# EasyEDA Pro project compute-module-v101.eprj, board main-board
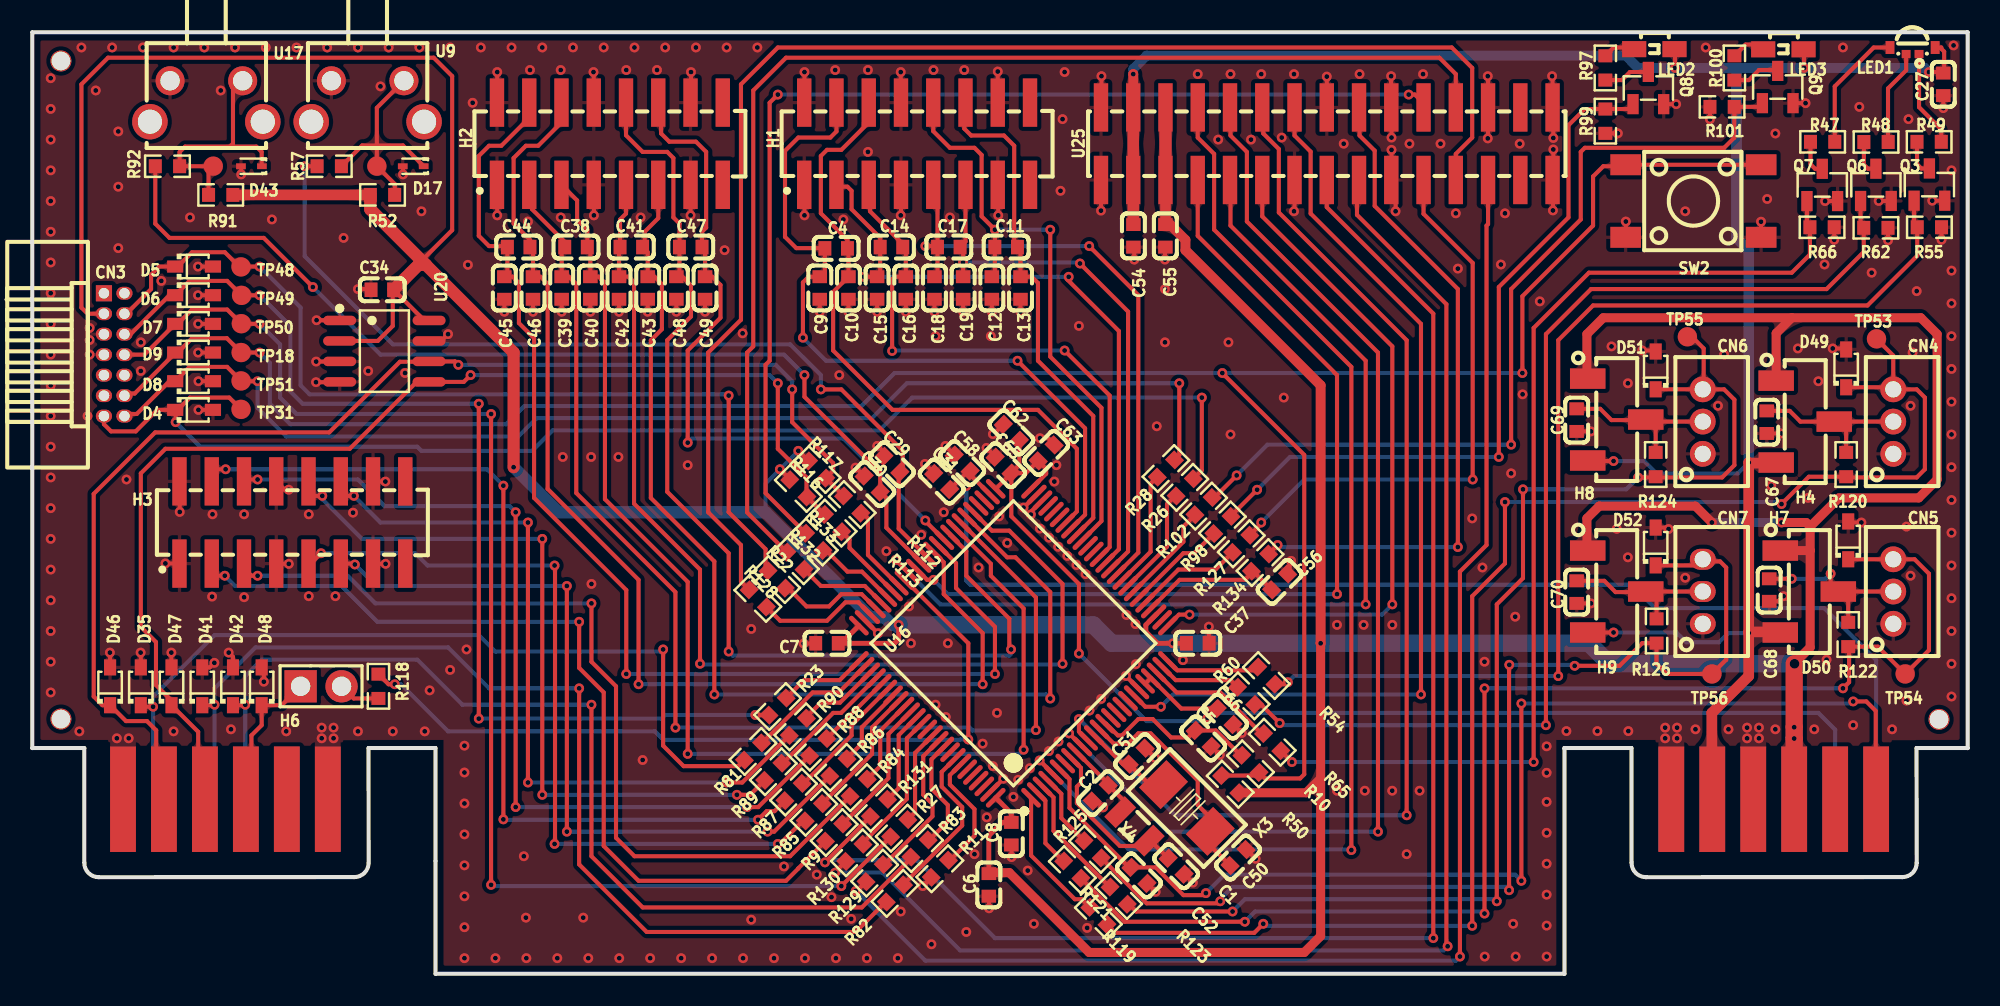
[diagram p8: board, top side]
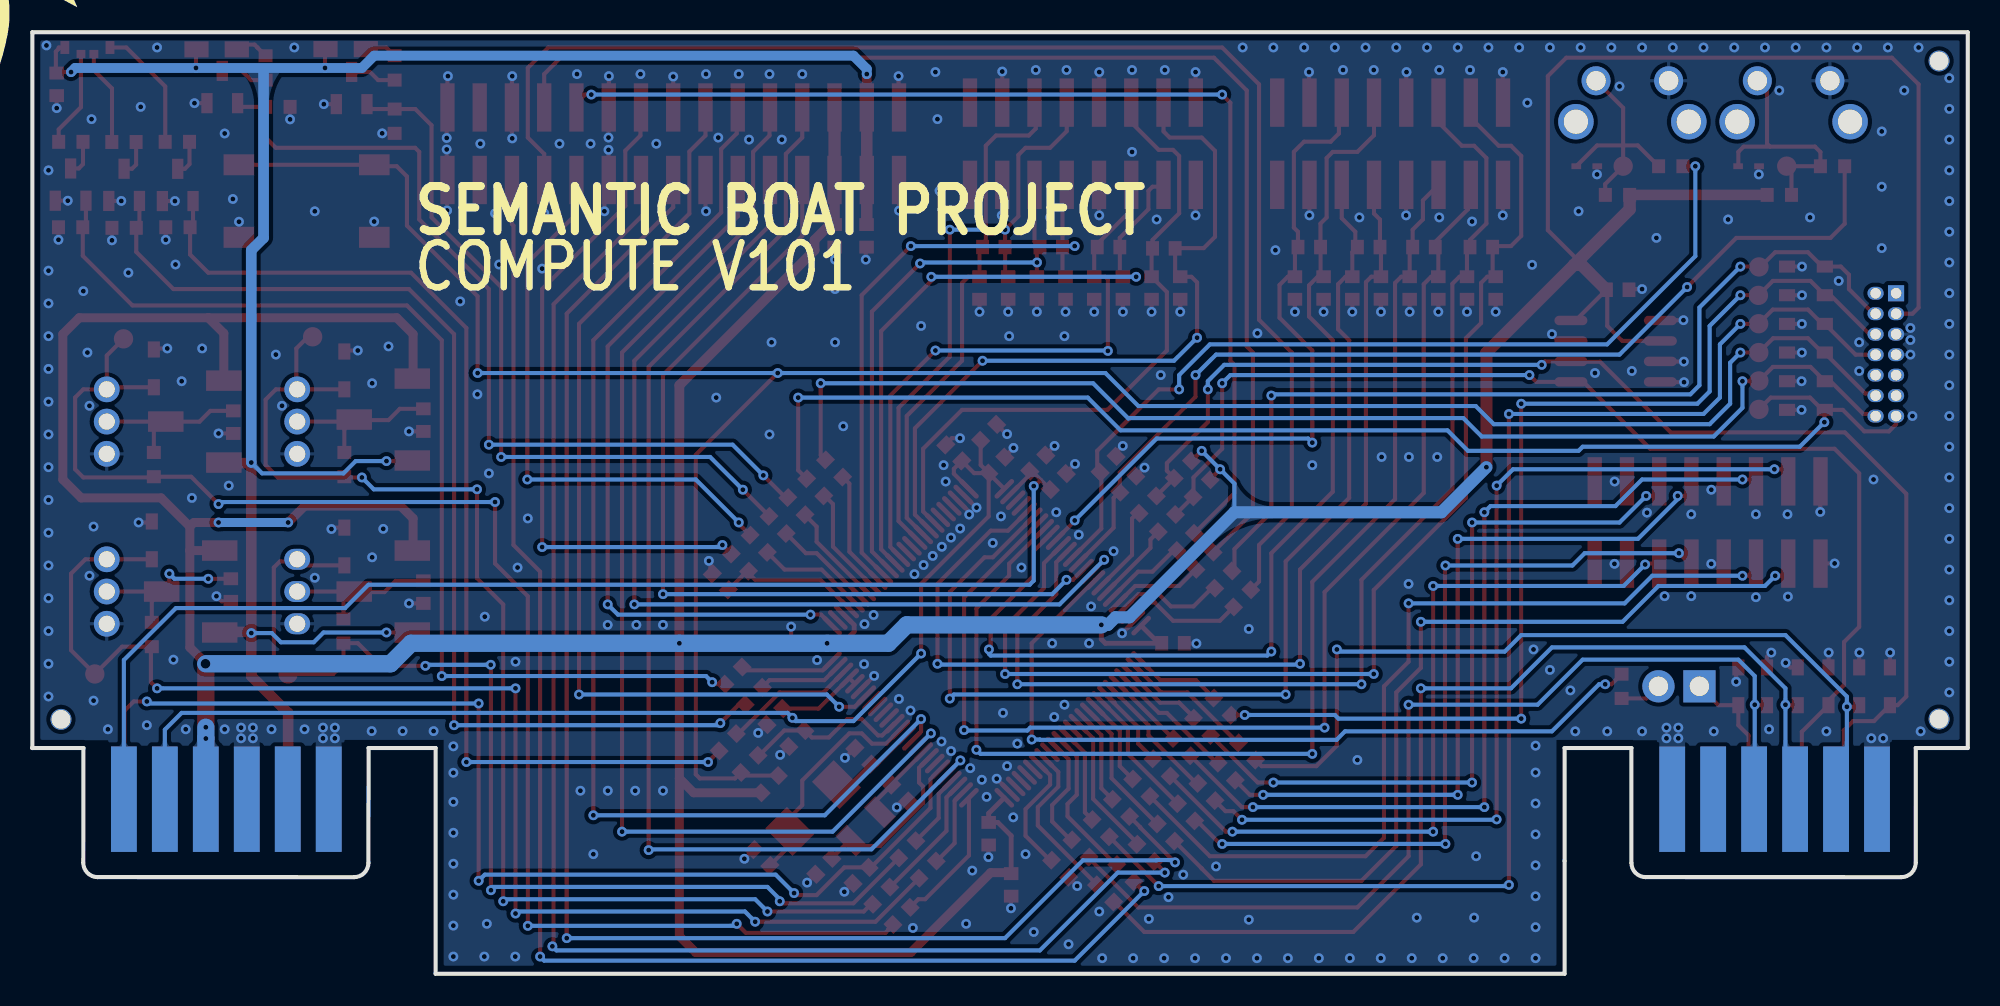
[diagram p9: board, bottom side, seen from below]

Outline 120.01 x 58.4 mm; copper layers: Top Layer, Inner1, Inner2, Bottom Layer. Coordinates in mm from the lower left corner of the outline.
Outline path: 120,14 120,58.4 0,58.4 0,14 3.22,14 3.23,6.88 arc(3.49,6.25) 4.11,5.99 19.96,5.99 arc(20.59,6.25) 20.86,6.88 20.85,14 25,14 25,0 95,0 95,14 99.16,14 99.16,6.88 arc(99.42,6.25) 100.05,5.99 115.95,5.99 arc(116.58,6.25) 116.84,6.88 116.83,14 120,14 ; 120,14 120.01,14
Stack: Top Layer 0.035mm Outer layer thickness 1oz / Dielectric1 0.2104mm 7628 RC49% 8.6mil / Inner1 0.0152mm Inner layer thickness / Dielectric2 1.065mm 1.1mm H/HOZ Copper / Inner2 0.0152mm Inner layer thickness / Dielectric3 0.2104mm 7628 RC49% 8.6mil / Bottom Layer 0.035mm Outer layer thickness 1oz

## Design rules (mm)
template: JLCPCB Capability(Two Layers Board)
spacing copperThickness1oz (default): track to track 0.102, other pairs 0.152 to 0.3
spacing copperThickness2oz: track to track 0.203, other pairs 0.152 to 0.3
track width copperThickness1oz (default): min 0.127, default 0.254, max 2.54
track width copperThickness2oz: min 0.203, default 0.254, max 2.54
differential pair differentialPair (default): width min 0.127, default 0.254, max 2.54; gap min 0.152, default 0.152
via viaSize (default): diameter min 0.5, default 0.61, max 10; hole min 0.3, default 0.305, max 6.3

## Placement (name value [footprint] x y rotation side)
C1  22pF  [C0603]  70.93 6.67 135 top
C2  22pF  [C0603]  66.22 11.21 45 top
C4  2.2nF  [C0603]  49.84 44.99 0 top
C5  100nF  [C0603]  72.6 14.59 135 top
C6  22uF  [C0603]  59.31 5.51 90 top
C7  100nF  [C0603]  49.28 20.5 180 top
C8  100nF  [C0603]  60.71 8.69 270 top
C9  22nF  [C0603]  48.83 42.54 270 top
C10  22nF  [C0603]  50.61 42.54 270 top
C11  2.2nF  [C0603]  60.38 45.08 0 top
C12  22nF  [C0603]  59.5 42.54 270 top
C13  22nF  [C0603]  61.27 42.54 270 top
C14  2.2nF  [C0603]  53.27 45.08 0 top
C15  22nF  [C0603]  52.38 42.54 270 top
C16  22nF  [C0603]  54.16 42.54 270 top
C17  2.2nF  [C0603]  56.83 45.08 0 top
C18  22nF  [C0603]  55.94 42.54 270 top
C19  22nF  [C0603]  57.72 42.54 270 top
C27  100nF  [C0603]  118.49 55.17 270 top
C29  100nF  [C0603]  53.3 31.6 315 top
C30  100nF  [C0603]  52.08 30.38 315 top
C31  1uF  [C0603]  56.39 30.53 315 top
C34  100nF  [C0603]  21.7 42.43 0 top
C37  100nF  [C0603]  72.26 20.5 0 top
C38  2.2nF  [C0603]  33.72 45.08 0 top
C39  22nF  [C0603]  32.83 42.54 270 top
C40  22nF  [C0603]  34.6 42.54 270 top
C41  2.2nF  [C0603]  37.14 45.08 0 top
C42  22nF  [C0603]  36.38 42.54 270 top
C43  22nF  [C0603]  38.16 42.54 270 top
C44  2.2nF  [C0603]  30.16 45.08 0 top
C45  22nF  [C0603]  29.27 42.54 270 top
C46  22nF  [C0603]  31.05 42.54 270 top
C47  2.2nF  [C0603]  40.83 45.08 0 top
C48  22nF  [C0603]  39.94 42.54 270 top
C49  22nF  [C0603]  41.72 42.54 270 top
C50  33pF  [C0603]  74.76 7.21 225 top
C51  33pF  [C0603]  68.5 13.5 225 top
C52  100nF  [C0603]  68.62 6.1 315 top
C54  10uF  [C0603]  68.28 45.77 90 top
C55  10uF  [C0603]  70.26 45.77 270 top
C56  10uF  [C0603]  77.34 24.31 45 top
C58  100nF  [C0603]  57.66 31.67 315 top
C62  4.7uF  [C0603]  60.71 33.58 135 top
C63  100nF  [C0603]  62.87 32.31 45 top
C65  100nF  [C0603]  60.2 31.55 135 top
C66  100nF  [C0603]  73.96 15.95 315 top
C67  10uF  [C0603]  107.54 34.21 90 top
C68  10uF  [C0603]  107.7 23.8 90 top
C69  10uF  [C0603]  95.76 34.34 90 top
C70  10uF  [C0603]  95.76 23.67 90 top
CN3  HX PZ1.27-2x7P WZ  [HDR-TH_14P-P1.27-H-M-R2-C7-S1.27-W7.5-N]  5.08 38.4 270 top
CN4  B3B-PH-K-S(LF)(SN)  [CONN-TH_B3B-PH-K-S]  115.39 34.25 270 top
CN5  B3B-PH-K-S(LF)(SN)  [CONN-TH_B3B-PH-K-S]  115.39 23.71 270 top
CN6  B3B-PH-K-S(LF)(SN)  [CONN-TH_B3B-PH-K-S]  103.58 34.25 270 top
CN7  B3B-PH-K-S(LF)(SN)  [CONN-TH_B3B-PH-K-S#2]  103.58 23.71 270 top
D4  PESD5V0U1UA,115  [SOD-323_L1.8-W1.3-LS2.5-RD]  10.03 34.98 0 top
D5  PESD5V0U1UA,115  [SOD-323_L1.8-W1.3-LS2.5-RD]  10.03 43.87 0 top
D6  PESD5V0U1UA,115  [SOD-323_L1.8-W1.3-LS2.5-RD]  10.03 42.09 0 top
D7  PESD5V0U1UA,115  [SOD-323_L1.8-W1.3-LS2.5-RD]  10.03 40.31 0 top
D8  PESD5V0U1UA,115  [SOD-323_L1.8-W1.3-LS2.5-RD]  10.03 36.75 0 top
D9  PESD5V0U1UA,115  [SOD-323_L1.8-W1.3-LS2.5-RD]  10.03 38.53 0 top
D17  PESD3V3S1UB,115  [SOD-523_L1.2-W0.8-LS1.6-RD]  23.62 50.09 180 top
D35  PESD5V0U1UA,115  [SOD-323_L1.8-W1.3-LS2.5-RD]  6.73 17.83 90 top
D41  PESD5V0U1UA,115  [SOD-323_L1.8-W1.3-LS2.5-RD]  10.54 17.83 90 top
D42  PESD5V0U1UA,115  [SOD-323_L1.8-W1.3-LS2.5-RD]  12.45 17.83 90 top
D43  PESD3V3S1UB,115  [SOD-523_L1.2-W0.8-LS1.6-RD]  13.59 50.09 180 top
D46  PESD5V0U1UA,115  [SOD-323_L1.8-W1.3-LS2.5-RD]  4.83 17.83 90 top
D47  PESD5V0U1UA,115  [SOD-323_L1.8-W1.3-LS2.5-RD]  8.64 17.83 90 top
D48  PESD5V0U1UA,115  [SOD-323_L1.8-W1.3-LS2.5-RD]  14.22 17.83 90 top
D49  PESD5V0U1UA,115  [SOD-323_L1.8-W1.3-LS2.5-RD]  112.47 37.55 90 top
D50  PESD5V0U1UA,115  [SOD-323_L1.8-W1.3-LS2.5-RD]  112.59 26.88 90 top
D51  PESD5V0U1UA,115  [SOD-323_L1.8-W1.3-LS2.5-RD]  100.66 37.42 90 top
D52  PESD5V0U1UA,115  [SOD-323_L1.8-W1.3-LS2.5-RD]  100.66 26.5 90 top
H1  XDZ200-2-08-S-2.0-G1  [HDR-SMD_16P-P2.00-V-M-R2-C8-LS6.5]  54.86 51.49 0 top
H2  XDZ200-2-08-S-2.0-G1  [HDR-SMD_16P-P2.00-V-M-R2-C8-LS6.5]  35.81 51.49 0 top
H3  XDZ200-2-08-S-2.0-G1  [HDR-SMD_16P-P2.00-V-M-R2-C8-LS6.5]  16.13 27.99 0 top
H4  X6511WVS-03H-C60D48R2  [HDR-SMD_3P-P2.54_XKB_X6511WVS-03H-C60D48R2]  109.93 34.25 270 top
H6  PZ254V-11-02P  [HDR-TH_2P-P2.54-V-M]  17.91 17.83 0 top
H7  X6511WVS-03H-C60D48R2  [HDR-SMD_3P-P2.54_XKB_X6511WVS-03H-C60D48R2]  110.18 23.71 270 top
H8  X6511WVS-03H-C60D48R2  [HDR-SMD_3P-P2.54_XKB_X6511WVS-03H-C60D48R2]  98.24 34.38 270 top
H9  X6511WVS-03H-C60D48R2  [HDR-SMD_3P-P2.54_XKB_X6511WVS-03H-C60D48R2]  98.24 23.71 270 top
LED1  MHS110RGBCT  [LED-ARRAY-SMD_MHS110RGBCT]  116.59 57.25 0 top
LED2  LTST-S220TGKT  [LED-SMD_L2.2-W0.6-RD_GREEN]  100.57 57.35 0 top
LED3  LTST-S220TGKT  [LED-SMD_L2.2-W0.6-RD_GREEN]  108.57 57.34 0 top
NOREF  -  [Pad_e36]  1.78 56.62 270 top
NOREF#2  -  [Pad_e35]  1.78 15.8 0 top
NOREF#3  -  [Pad_e37]  118.22 15.78 90 top
Q3  2N7002  [SOT-23-3_L2.9-W1.3-P1.90-LS2.4-BR]  117.63 48.95 270 top
Q6  2N7002  [SOT-23-3_L2.9-W1.3-P1.90-LS2.4-BR]  114.31 48.94 270 top
Q7  2N7002  [SOT-23-3_L2.9-W1.3-P1.90-LS2.4-BR]  110.99 48.93 270 top
Q8  2N7002  [SOT-23-3_L2.9-W1.3-P1.90-LS2.4-BR]  100.2 54.94 270 top
Q9  2N7002  [SOT-23-3_L2.9-W1.3-P1.90-LS2.4-BR]  108.22 55 270 top
R9  1kΩ  [R0603]  49.72 8.76 225 top
R10  220Ω  [R0603]  75.53 13.02 135 top
R11  47kΩ  [R0603]  56.27 6.51 45 top
R22  47Ω  [R0603]  46.15 24.45 135 top
R23  47Ω  [R0603]  46.21 16.57 225 top
R26  100Ω  [R0603]  71.46 30.17 45 top
R27  100Ω  [R0603]  53.76 9.03 225 top
R28  100Ω  [R0603]  70.29 31.34 45 top
R47  120Ω  [R0603]  111.01 51.6 0 top
R48  100Ω  [R0603]  114.32 51.59 0 top
R49  100Ω  [R0603]  117.61 51.6 0 top
R50  10kΩ  [R0603]  74.28 11.76 315 top
R52  10kΩ  [R0603]  21.72 48.31 180 top
R54  100Ω  [R0603]  76.52 18.5 135 top
R55  100kΩ  [R0603]  117.63 46.3 0 top
R57  1kΩ  [R0603]  18.42 50.09 180 top
R60  100Ω  [R0603]  75.26 17.24 315 top
R62  100kΩ  [R0603]  114.31 46.27 0 top
R65  100Ω  [R0603]  76.88 14.36 315 top
R66  100kΩ  [R0603]  110.97 46.3 0 top
R81  47Ω  [R0603]  44.69 13.79 225 top
R82  47Ω  [R0603]  53.49 4.99 225 top
R83  47Ω  [R0603]  55.01 7.77 225 top
R84  1kΩ  [R0603]  51.24 11.54 225 top
R85  1kΩ  [R0603]  48.46 10.02 225 top
R86  1kΩ  [R0603]  49.99 12.8 225 top
R87  1kΩ  [R0603]  47.2 11.27 225 top
R88  1kΩ  [R0603]  48.73 14.06 225 top
R89  1kΩ  [R0603]  45.94 12.53 225 top
R90  1kΩ  [R0603]  47.47 15.31 225 top
R91  10kΩ  [R0603]  11.68 48.31 0 top
R92  1kΩ  [R0603]  8.38 50.09 180 top
R97  120Ω  [R0603]  97.54 56.19 90 top
R98  100Ω  [R0603]  73.79 27.84 225 top
R99  100kΩ  [R0603]  97.54 52.88 270 top
R100  120Ω  [R0603]  105.54 56.19 90 top
R101  100kΩ  [R0603]  104.78 53.77 180 top
R102  100Ω  [R0603]  72.62 29.01 225 top
R112  47Ω  [R0603]  50.84 29.1 135 top
R113  47Ω  [R0603]  49.65 27.95 135 top
R116  2.2kΩ  [R0603]  47.5 30.11 135 top
R117  2.2kΩ  [R0603]  48.67 31.28 135 top
R118  330Ω  [R0603]  21.46 17.83 270 top
R119  220Ω  [R0603]  66.1 3.59 315 top
R120  4.7kΩ  [R0603]  112.47 31.58 270 top
R121  220Ω  [R0603]  64.49 6.46 315 top
R122  4.7kΩ  [R0603]  112.59 21.04 270 top
R123  220Ω  [R0603]  67.36 4.84 315 top
R124  4.7kΩ  [R0603]  100.66 31.58 270 top
R125  220Ω  [R0603]  65.75 7.72 315 top
R126  4.7kΩ  [R0603]  100.71 21.26 270 top
R127  47Ω  [R0603]  74.96 26.67 45 top
R128  47Ω  [R0603]  44.99 23.28 135 top
R129  47Ω  [R0603]  52.23 6.24 225 top
R130  47Ω  [R0603]  50.97 7.5 225 top
R131  47Ω  [R0603]  52.5 10.29 225 top
R132  47Ω  [R0603]  47.32 25.62 315 top
R133  47Ω  [R0603]  48.49 26.79 315 top
R134  33Ω  [R0603]  76.13 25.5 225 top
SW2  TS-1002S-05026C  [KEY-SMD_4P-L6.0-W6.0-P4.50-LS9.0]  103 47.93 0 top
TP17  -  [Test-Point-0.5mm]  21.37 50.09 180 top
TP18  -  [Test-Point-0.5mm]  12.95 38.53 0 top
TP31  -  [Test-Point-0.5mm]  12.95 35.01 0 top
TP48  -  [Test-Point-0.5mm]  12.94 43.84 0 top
TP49  -  [Test-Point-0.5mm]  12.98 42.08 0 top
TP50  -  [Test-Point-0.5mm]  12.96 40.32 0 top
TP51  -  [Test-Point-0.5mm]  12.95 36.77 0 top
TP52  -  [Test-Point-0.5mm]  11.22 50.09 180 top
TP53  -  [Test-Point-0.5mm]  114.35 39.38 270 top
TP54  -  [Test-Point-0.5mm]  116.13 18.59 0 top
TP55  -  [Test-Point-0.5mm]  102.62 39.51 270 top
TP56  -  [Test-Point-0.5mm]  104.15 18.59 180 top
U9  TC-6615-9.0-160G  [KEY-TH_PTS645VXX83XLFS]  20.8 54.12 180 top
U16  STM32F373VCT6  [LQFP-100_L14.0-W14.0-P0.50-LS16.0-BL]  60.83 20.5 45 top
U17  TC-6615-9.0-160G  [KEY-TH_PTS645VXX83XLFS]  10.8 54.12 180 top
U20  AT24C256C-SSHL-T  [SOIC-8_L4.9-W3.9-P1.27-LS6.0-BL]  21.83 38.62 270 top
U23  -  [ED12BGFBK-CARD]  108 6 0 top
U24  -  [ED12BGFBK-CARD]  12 6 0 top
U25  XDZ200-2-15-S-2.0-G1  [HDR-SMD_30P-P2.00-V-M-R2-C15-LS6.5]  80.26 51.49 0 top
X3  8MHz  [CRYSTAL-SMD_L5.0-W3.2]  71.59 10.28 135 top
X4  32.768kHz  [FC-135R_L3.2-W1.5]  68.34 9.14 315 top

## Footprints (pads in the part's own frame, mm; a bottom-side part is the same pattern mirrored in y, then rotated)
C0603
  rect 0.8x0.9 smd: 1(-0.7,0) 2(0.7,0)
CONN-TH_B3B-PH-K-S
  round 1.6 hole 1: 1(2,0) 2(0,0) 3(-2,0)
CONN-TH_B3B-PH-K-S#2
  oval 1.3x1.6 hole 1: 1(2,0) 2(0,0) 3(-2,0)
CRYSTAL-SMD_L5.0-W3.2
  rect 1.9x2.4 smd: 1(-2.05,0) 2(2.05,0)
ED12BGFBK-CARD
  rect 1.6x6.54 smd far side: 1(-6.375,4.826) 2(-3.835,4.826) 3(-1.295,4.826) 4(1.245,4.826) 5(3.785,4.826) 6(6.325,4.826)
  rect 1.6x6.54 smd: 7(6.325,4.826) 8(3.785,4.826) 9(1.245,4.826) 10(-1.295,4.826) 11(-3.835,4.826) 12(-6.375,4.826)
FC-135R_L3.2-W1.5
  rect 1x1.8 smd: 1(-1.25,0) 2(1.25,0)
HDR-SMD_3P-P2.54_XKB_X6511WVS-03H-C60D48R2
  rect 1.27x2.2 smd: 1(-2.54,-1.8) 2(0,1.8) 3(2.54,-1.8)
HDR-SMD_16P-P2.00-V-M-R2-C8-LS6.5
  rect 0.89x3 smd: 1(-7,-2.55) 2(-7,2.55) 3(-5,-2.55) 4(-5,2.55) 5(-3,-2.55) 6(-3,2.55) 7(-1,-2.55) 8(-1,2.55) 9(1,-2.55) 10(1,2.55) 11(3,-2.55) 12(3,2.55) 13(5,-2.55) 14(5,2.55) 15(7,-2.55) 16(7,2.55)
HDR-SMD_30P-P2.00-V-M-R2-C15-LS6.5
  rect 0.89x3 smd: 1(-14,-2.25) 2(-14,2.25) 3(-12,-2.25) 4(-12,2.25) 5(-10,-2.25) 6(-10,2.25) 7(-8,-2.25) 8(-8,2.25) 9(-6,-2.25) 10(-6,2.25) 11(-4,-2.25) 12(-4,2.25) 13(-2,-2.25) 14(-2,2.25) 15(0,-2.25) 16(0,2.25) 17(2,-2.25) 18(2,2.25) 19(4,-2.25) 20(4,2.25) 21(6,-2.25) 22(6,2.25) 23(8,-2.25) 24(8,2.25) 25(10,-2.25) 26(10,2.25) 27(12,-2.25) 28(12,2.25) 29(14,-2.25) 30(14,2.25)
HDR-TH_2P-P2.54-V-M
  rect 2x2 hole 1.2: 1(-1.27,0)
  round 2 hole 1.2: 2(1.27,0)
HDR-TH_14P-P1.27-H-M-R2-C7-S1.27-W7.5-N
  rect 1x1 hole 0.65: 1(-3.81,-0.635)
  oval 0.8x1 hole 0.65: 2(-3.81,0.635) 3(-2.54,-0.635) 4(-2.54,0.635) 5(-1.27,-0.635) 6(-1.27,0.635) 7(0,-0.635) 8(0,0.635) 9(1.27,-0.635) 10(1.27,0.635) 11(2.54,-0.635) 12(2.54,0.635) 13(3.81,-0.635) 14(3.81,0.635)
KEY-SMD_4P-L6.0-W6.0-P4.50-LS9.0
  rect 1.9x1.3 smd: 1(-4.2,2.25) 2(4.2,2.25) 3(-4.2,-2.25) 4(4.2,-2.25)
KEY-TH_PTS645VXX83XLFS
  round 1.8 hole 1.2: 1(-2.25,-1.27) 2(2.25,-1.27)
  round 2.2 hole 1.5: 3(-3.5,1.27) 4(3.5,1.27)
LED-ARRAY-SMD_MHS110RGBCT
  rect 0.55x0.5 smd: 1(0.4,-0.2) 4(-0.4,-0.2)
  rect 0.55x0.8 smd: 2(1.4,0.2) 3(-1.4,0.2)
LED-SMD_L2.2-W0.6-RD_GREEN
  rect 1.5x1 smd: 1(-1.25,0) 2(1.25,0)
LQFP-100_L14.0-W14.0-P0.50-LS16.0-BL
  oval 0.3x1.6 smd: 1(-6,-7.55) 2(-5.5,-7.55) 3(-5,-7.55) 4(-4.5,-7.55) 5(-4,-7.55) 6(-3.5,-7.55) 7(-3,-7.55) 8(-2.5,-7.55) 9(-2,-7.55) 10(-1.5,-7.55) 11(-1,-7.55) 12(-0.5,-7.55) 13(0,-7.55) 14(0.5,-7.55) 15(1,-7.55) 16(1.5,-7.55) 17(2,-7.55) 18(2.5,-7.55) 19(3,-7.55) 20(3.5,-7.55) 21(4,-7.55) 22(4.5,-7.55) 23(5,-7.55) 24(5.5,-7.55) 25(6,-7.55) 51(6,7.55) 52(5.5,7.55) 53(5,7.55) 54(4.5,7.55) 55(4,7.55) 56(3.5,7.55) 57(3,7.55) 58(2.5,7.55) 59(2,7.55) 60(1.5,7.55) 61(1,7.55) 62(0.5,7.55) 63(0,7.55) 64(-0.5,7.55) 65(-1,7.55) 66(-1.5,7.55) 67(-2,7.55) 68(-2.5,7.55) 69(-3,7.55) 70(-3.5,7.55) 71(-4,7.55) 72(-4.5,7.55) 73(-5,7.55) 74(-5.5,7.55) 75(-6,7.55)
  oval 1.6x0.3 smd: 26(7.55,-6) 27(7.55,-5.5) 28(7.55,-5) 29(7.55,-4.5) 30(7.55,-4) 31(7.55,-3.5) 32(7.55,-3) 33(7.55,-2.5) 34(7.55,-2) 35(7.55,-1.5) 36(7.55,-1) 37(7.55,-0.5) 38(7.55,0) 39(7.55,0.5) 40(7.55,1) 41(7.55,1.5) 42(7.55,2) 43(7.55,2.5) 44(7.55,3) 45(7.55,3.5) 46(7.55,4) 47(7.55,4.5) 48(7.55,5) 49(7.55,5.5) 50(7.55,6) 76(-7.55,6) 77(-7.55,5.5) 78(-7.55,5) 79(-7.55,4.5) 80(-7.55,4) 81(-7.55,3.5) 82(-7.55,3) 83(-7.55,2.5) 84(-7.55,2) 85(-7.55,1.5) 86(-7.55,1) 87(-7.55,0.5) 88(-7.55,0) 89(-7.55,-0.5) 90(-7.55,-1) 91(-7.55,-1.5) 92(-7.55,-2) 93(-7.55,-2.5) 94(-7.55,-3) 95(-7.55,-3.5) 96(-7.55,-4) 97(-7.55,-4.5) 98(-7.55,-5) 99(-7.55,-5.5) 100(-7.55,-6)
Pad_e35
  round 1.3 hole 1.152: 1(0,0)
Pad_e36
  round 1.3 hole 1.152: 1(0,0)
Pad_e37
  round 1.3 hole 1.152: 1(0,0)
R0603
  rect 0.806x0.864 smd: 1(-0.753,0) 2(0.753,0)
SOD-323_L1.8-W1.3-LS2.5-RD
  rect 1x0.75 smd: 1(-1.173,0) 2(1.173,0)
SOD-523_L1.2-W0.8-LS1.6-RD
  rect 0.6x0.36 smd: 1(-0.65,0) 2(0.65,0)
SOIC-8_L4.9-W3.9-P1.27-LS6.0-BL
  oval 0.588x2.045 smd: 1(-1.905,-2.772) 2(-0.635,-2.772) 3(0.635,-2.772) 4(1.905,-2.772) 5(1.905,2.772) 6(0.635,2.772) 7(-0.635,2.772) 8(-1.905,2.772)
SOT-23-3_L2.9-W1.3-P1.90-LS2.4-BR
  rect 1.25x0.7 smd: 1(1,-0.95) 2(1,0.95) 3(-1,0)
Test-Point-0.5mm
  round 1.2 smd: 1(0,0)

## Nets
As in the schematic.

Pads without a net: CN3 1 2 9 10 11; H1 15 16; H2 15 16; H3 15 16; NOREF 1; NOREF#2 1; NOREF#3 1; U9 3 4; U16 7 15 16 17 18 27 39 40 45 46 47 53 54 88 92 95 96 97 98; U17 3 4; U23 2 8; U24 5 8; U25 27 28

## Via types
v1: diameter 0.61, hole 0.305, Top Layer to Bottom Layer, 583 vias
v2: diameter 1, hole 0.6, Top Layer to Bottom Layer, 1 via

## Routing (per net, layer and track width the routed paths; a pad name or vN(x,y) marks a point on that pad's centre or on a via; arc(x,y) is an arc through that point)
+3V3: length 371.8
  Top Layer w0.254: C34.2 24.31,40.52 U20.8 ; 22.35,42.37 22.35,40.18 21.42,39.25 U20.2 ; CN3.3 3.43,40.94 3.05,41.32 3.05,55.17 4.7,56.82 24.89,56.82 26.03,55.68 26.03,46.12 24.14,44.23 ; R116.2 46.97,30.68 v1(46.35,31.29) ; v1(47.5,32.44) 47.51,32.44 48.13,31.81
  Top Layer w0.3: C37.1 v1(70.72,20.5) 69.76,20.5 69.05,21.22 69.05,21.64 69.71,22.3 ; U16.100 60.71,9.95 C8.1 60.14,9.39 59.31,8.56 C6.2 ; 50.16,20.5 U16.75
  Top Layer w0.305: v1(53.72,21.64) 53.72,20.75 53.47,20.5 C7.1
  Top Layer w0.559: v1(108.46,27.99) 109.98,27.99 110.24,27.74 ; 110.24,26.26 110.24,20.24 109.25,19.25 ; 110.24,26.26 110.24,27.74 ; 110.24,26.26 110.23,26.25 H7.1 ; 79.88,12.12 78.99,11.23 74.81,11.23 ; 79.88,12.12 79.88,2.34 78.87,1.32 65.53,1.32 60.58,6.27 59.37,6.27 C6.2 ; 79.88,12.12 v1(79.88,20.5) ; H8.1 96.39,36.97 96.39,39.68 97.41,40.69 109.09,40.69 ; 110.24,27.74 112.01,29.52 116.97,29.52 118.11,30.66 118.11,39.68 117.09,40.69 109.09,40.69 ; H9.1 96.39,26.3 96.39,28.25 97.16,29.01 103.12,29.01 v1(104.14,27.99) ; 109.09,40.69 108.13,39.73 H4.1
  Top Layer w0.61: 70.28,46.45 70.56,46.45 71.5,45.52 71.5,44.88 79.88,36.5 v1(79.88,20.5)
  Top Layer w0.66: R52.2 R91.2 ; U25.5 70.26,46.5
  Top Layer w0.75: v1(29.84,31.42) 29.84,38.53 24.4,43.97
  Top Layer w0.762: R52.2 20.96,47.41 24.4,43.97 23.95,43.97 C34.2 ; U25.5 U25.6
  Top Layer w1.067: U23.4 v1(109.25,14.59) v1(109.25,15.29) 109.25,19.23
  Bottom Layer w0.254: v1(47.5,32.44) v1(46.35,31.29) 45.47,30.4 45.47,28.63
  Bottom Layer w0.559: v1(108.46,27.99) v1(104.14,27.99)
  Bottom Layer w0.75: v1(29.84,31.42) 32.64,28.63 45.47,28.63 51.98,22.11 52.84,22.11 53.31,21.64 v1(53.72,21.64)
  Bottom Layer w1.067: v1(109.25,15.29) v1(109.25,14.59) U23.4 ; 109.25,19.23 97.79,19.23 96.52,20.5 v1(79.88,20.5) v1(70.72,20.5) 66.93,20.5 65.79,21.64 v1(53.72,21.64)
  vias: v2(109.27,19.23)
+5V: length 136.4
  Top Layer w0.254: LED3.2 109.85,57.31 v1(109.85,56.19) ; LED2.2 101.85,57.32 v1(101.85,56.19) ; v1(117.6,55.93) 118.43,55.93 118.49,55.87 118.54,55.92 118.54,57.2 118.36,57.38 118.36,57.45 LED1.2 ; H8.3 96.48,31.8 v1(98.04,31.8) ; H9.3 v1(98.04,21.17)
  Top Layer w0.61: U25.4 v1(68.26,55.8)
  Top Layer w0.66: H4.3 108.09,31.67 107.31,31.67 ; 107.31,31.67 107.35,31.71 ; 107.31,31.67 106.46,31.67 v1(106.43,31.71) 106.43,21.2 ; 106.43,21.2 108.35,21.2 H7.3 ; 106.43,21.2 v1(106.43,21.13) 106.43,18.47 104.14,16.18 104.14,10.85 U23.11
  Top Layer w0.711: C54.2 68.26,46.48 U25.3 U25.4
  Bottom Layer w0.254: v1(106.43,31.71) 105.76,31.04 100.71,31.04 99.95,31.8 v1(98.04,31.8) ; v1(98.04,21.17) 101.95,21.17 102.55,20.56 104.58,20.56 105.16,21.13 v1(106.43,21.13)
  Bottom Layer w0.61: v1(117.6,55.93) 117.35,56.19 v1(109.85,56.19) v1(101.85,56.19) 99.57,56.19 98.81,56.95 69.09,56.95 68.26,56.12 v1(68.26,55.8)
  Bottom Layer w0.66: 105.66,56.06 105.66,45.64 106.43,44.88 v1(106.43,31.71)
GND: length 129.3
  Top Layer w0.254: SW2.4 107.19,45.69 v1(107.19,46.65) ; v1(47.88,47.04) 47.88,48.92 H1.1 ; v1(104.02,53) R101.2 ; H3.13 21.14,25.43 v1(21.91,25.43) ; v1(115.06,45.49) R62.2 ; v1(17.6,37.97) 19.05,37.97 U20.3 ; U16.49 61.47,28.92 v1(61.46,28.92) ; v1(99.82,38.66) 100.59,38.66 D51.2 ; H3.14 21.14,30.53 v1(21.89,30.53) ; U20.4 19.04,36.7 v1(17.59,36.7) ; v1(66.4,10.32) 66.01,10.71 C2.1 ; v1(70.23,44.3) 70.23,45.07 ; C70.1 v1(96.65,22.97) ; D50.2 112.66,27.99 v1(113.41,27.99) ; C58.1 57.16,32.2 v1(56.62,32.74) ; v1(15.91,25.43) 15.14,25.43 H3.7 ; C7.2 48.56,20.48 v1(47.82,20.48) ; v1(98.81,46.66) 98.81,45.69 98.8,45.68 ; v1(62.48,33.22) 62.99,33.22 63.36,32.85 C63.2 ; D35.2 6.73,19.91 v1(6.72,19.92) ; v1(29.27,41.06) C45.2 ; v1(55.22,5.44) 55.74,5.96 55.74,5.98 ; v1(52.39,32.74) 52.41,32.74 52.93,32.22 ; C50.1 75.28,7.7 v1(75.85,7.13) ; v1(61.27,41.06) C13.2 ; H1.2 47.88,54.05 v1(47.88,55.93) ; v1(117.8,47.95) 118.58,47.95 ; v1(8.62,19.92) 8.62,19.02 D47.2 ; v1(67.81,18.48) 68.65,17.64 U16.20 ; H3.1 9.12,25.45 v1(8.25,25.45) ; v1(84.25,55.68) 84.25,53.75 U25.20 84.28,53.72 v1(84.28,51.87) ; v1(73.64,13.58) 73.12,14.1 C5.1 ; H1.13 59.89,48.91 v1(59.89,47.04) ; D43.2 12.95,50.07 v1(12.95,49.58) ; v1(34.8,55.93) 34.81,55.92 H2.8 ; C34.1 20.96,42.47 v1(20.19,42.47) ; D17.2 22.99,50.07 v1(22.99,49.58) ; H3.8 15.65,30.02 v1(15.9,30.02) ; v1(55.94,41.06) C18.2 ; v1(14.36,18.11) 14.36,18.87 D48.2 ; v1(41.72,41.06) C49.2 ; C65.2 59.7,32.08 v1(59.17,32.62) ; v1(84.53,47.3) 84.53,48.97 U25.19 84.28,49.25 v1(84.28,51.11) ; v1(98.31,52.13) R99.2 ; v1(111.73,45.53) R66.2 ; v1(90.25,51.82) 90.26,51.83 U25.26 90.26,55.66 v1(90.25,55.68) ; v1(114.49,47.94) Q6.2 ; v1(9.14,28.65) 9.14,30.53 H3.2 ; 77.97,24.68 77.97,25.52 v1(78.05,25.61) ; 6.1,11.3 U24.1 ; v1(25.78,39.68) 25.36,39.25 U20.7 ; v1(10.3,34.98) D4.2 ; v1(50.61,41.06) C10.2 ; v1(108.59,23.42) 108.27,23.1 C68.1 ; C66.2 74.48,15.46 v1(75,14.94) ; v1(48.83,41.06) C9.2 ; v1(10.28,42.09) D6.2 ; v1(109.95,54) Q9.2 ; v1(53.85,55.93) 53.85,54.05 H1.8 ; v1(31.05,41.06) C46.2 ; H2.7 34.82,48.93 v1(34.82,47.04) ; v1(111.16,47.93) Q7.2 ; v1(111.63,38.79) 112.41,38.79 D49.2 ; v1(69.66,5.09) 69.13,5.61 C52.2 ; v1(118.38,45.53) R55.2 ; C69.1 v1(96.65,33.64) ; C37.2 72.95,20.51 v1(72.95,21.53) ; 51.61,21.95 v1(52.43,21.12) ; 55.89,31.03 55.89,31.08 v1(55.35,31.62) ; v1(68.33,44.3) 68.33,45.07 ; v1(69.62,13.39) 69.02,13.99 C51.1 ; D52.2 101.37,27.68 v1(101.46,27.59) ; H1.7 53.86,47.06 v1(53.85,47.04) ; v1(71.96,5.65) 71.44,6.17 C1.1 ; 60.71,7.99 60.72,7.97 v1(60.72,7.24) ; D46.2 4.83,19.91 v1(4.81,19.92) ; v1(118.49,53.69) C27.2 ; D42.2 12.45,19.66 v1(12.18,19.92) ; D41.2 11.01,19 v1(11.29,19.29) ; U16.48 61.91,28.65 v1(61.91,28.48) ; C67.1 v1(108.46,33.51) ; H2.14 40.84,54.07 v1(40.84,55.93) ; v1(10.29,40.31) D7.2 ; C62.2 59.61,33.47 v1(59.56,33.47) ; v1(59.32,4.06) 59.32,4.8 C6.1 ; v1(94.31,51.84) 94.31,53.69 U25.30 94.26,55.65 v1(94.23,55.68) ; v1(78.23,47.3) 78.26,47.33 U25.13 ; v1(94.28,47.35) 94.28,49.22 U25.29 94.31,49.28 v1(94.31,51.13) ; v1(36.38,41.06) C42.2 ; v1(10.3,36.75) D8.2 ; v1(17.63,40.54) 19.04,40.54 U20.1 ; v1(10.28,43.87) D5.2 ; U16.99 60.21,12.1 ; v1(66.29,55.68) 66.29,53.77 U25.2 ; v1(34.6,41.06) C40.2 ; H2.2 28.83,54.05 v1(28.83,55.93) ; v1(54.16,41.06) C16.2 ; v1(57.72,41.06) C19.2 ; v1(51.04,31.39) 51.06,31.39 C30.1 ; v1(38.16,41.06) C43.2 ; v1(59.86,55.96) H1.14 ; v1(80.26,55.65) U25.16 ; v1(32.83,41.06) C39.2 ; H2.13 40.82,48.93 v1(40.82,47.04) ; v1(39.94,41.06) C48.2 ; v1(28.83,47.04) 28.83,48.92 H2.1 ; v1(59.5,41.06) C12.2 ; v1(101.93,53.94) Q8.2 ; v1(52.38,41.06) C15.2 ; v1(10.29,38.53) D9.2 ; v1(66.26,47.33) U25.1
  vias: v1(1.14,55.55) v1(1.14,53.65) v1(1.14,51.74) v1(1.14,49.84) v1(1.14,47.93) v1(1.14,46.03) v1(1.14,44.12) v1(1.14,42.22) v1(1.14,40.31) v1(1.14,38.41) v1(1.14,36.5) v1(1.14,34.59) v1(1.14,32.69) v1(1.14,30.79) v1(1.14,28.88) v1(1.14,26.98) v1(1.14,25.07) v1(1.14,23.17) v1(1.14,21.26) v1(1.14,19.36) v1(1.14,17.45) v1(2.92,15.04) v1(3.05,57.46) v1(3.43,34.59) v1(3.56,40.06) v1(3.56,39.31) v1(3.56,38.41) v1(3.94,54.79) v1(4.95,57.46) v1(5.24,14.61) v1(5.33,52.25) v1(5.33,48.82) v1(5.33,45.01) v1(5.84,30.66) v1(5.98,14.61) v1(6.73,39.17) v1(6.73,37.39) v1(6.86,57.46) v1(8,42.98) v1(8.76,57.46) v1(8.76,15.04) v1(9.78,46.91) v1(10.67,57.46) v1(11.18,28.5) v1(11.15,23.39) v1(11.68,54.79) v1(12.32,15.16) v1(12.57,57.46) v1(13.14,28.5) v1(13.14,23.36) v1(14.48,57.46) v1(14.86,46.79) v1(15.75,15.04) v1(16.38,57.46) v1(17.14,28.5) v1(17.14,23.42) v1(17.94,15.27) v1(17.94,14.61) v1(18.29,57.46) v1(18.68,15.27) v1(18.68,14.61) v1(18.8,23.42) v1(19.3,45.64) v1(19.89,28.6) v1(20.19,57.46) v1(20.19,15.04) v1(20.83,37.39) v1(21.59,55.04) v1(22.1,57.46) v1(22.35,15.04) v1(23.11,37.26) v1(24,57.46) v1(24.13,47.3) v1(24.33,15.04) v1(24.64,17.58) v1(25.91,57.46) v1(25.91,18.85) v1(26.8,14.15) v1(26.8,12.48) v1(26.8,10.56) v1(26.8,8.64) v1(26.8,6.72) v1(26.8,4.81) v1(26.8,2.89) v1(26.8,0.97) v1(26.92,20.12) v1(27.01,43.97) v1(27.31,54.03) v1(27.81,57.46) v1(28.72,0.97) v1(29.72,57.46) v1(30.48,7.29) v1(30.61,3.48) v1(30.64,0.97) v1(30.73,46.66) v1(30.86,56.06) v1(31.62,57.46) v1(32.56,0.97) v1(32.77,56.06) v1(32.77,46.91) v1(32.89,32.06) v1(33.53,57.46) v1(34.16,3.48) v1(34.47,0.97) v1(34.65,32.06) v1(34.67,24.18) v1(35.43,57.46) v1(36.34,32.06) v1(36.39,0.97) v1(36.83,56.06) v1(37.34,57.46) v1(37.72,46.91) v1(37.85,13.26) v1(38.31,0.97) v1(38.74,56.06) v1(39.24,57.46) v1(40.23,0.97) v1(40.64,31.55) v1(41.15,57.46) v1(42.15,0.97) v1(42.93,44.88) v1(43.05,57.46) v1(44.04,39.73) v1(44.07,0.97) v1(44.58,21.39) v1(44.58,3.35) v1(44.96,57.46) v1(45.99,0.97) v1(46.61,6.66) v1(47.91,0.97) v1(48.64,6.15) v1(49.56,4.75) v1(49.78,56.06) v1(49.83,0.97) v1(50.04,37.14) v1(50.29,46.79) v1(50.77,3.4) v1(51.75,0.97) v1(51.82,56.06) v1(51.82,50.98) v1(52.96,26.21) v1(53.67,0.97) v1(53.85,3.86) v1(54.36,22.78) v1(54.48,20.5) v1(55.12,27.23) v1(55.75,1.83) v1(55.88,56.06) v1(56.01,39.55) v1(56.01,16.69) v1(56.51,28.63) v1(56.64,15.93) v1(56.77,20.5) v1(56.9,46.91) v1(57.78,56.06) v1(57.91,2.59) v1(58.42,7.42) v1(58.67,25.2) v1(58.93,14.28) v1(59.18,9.7) v1(59.44,39.55) v1(59.56,12.88) v1(59.82,16.18) v1(59.94,28.37) v1(60.21,12.1) v1(60.45,26.72) v1(60.83,10.97) v1(61.13,12.03) v1(61.72,6.4) v1(61.85,12.75) v1(62.1,3.1) v1(62.48,27.62) v1(63.04,27.05) v1(63.04,13.81) v1(63.37,30.53) v1(63.5,31.55) v1(63.61,26.48) v1(63.63,14.41) v1(63.75,48.57) v1(63.88,53.01) v1(64.01,55.93) v1(64.18,25.92) v1(64.74,25.35) v1(64.9,40.18) v1(65.31,24.79) v1(65.41,2.84) v1(65.55,16.33) v1(66.27,17.05) v1(67.84,22.25) v1(68.41,21.69) v1(68.43,19.21) v1(69.72,33.96) v1(70.23,42.47) v1(70.23,39.17) v1(71.34,19.45) v1(72.26,55.8) v1(73.53,51.74) v1(74.17,39.17) v1(74.29,55.8) v1(74.29,33.45) v1(75.56,51.74) v1(76.2,55.8) v1(77.47,51.87) v1(77.6,35.74) v1(78.23,55.8) v1(80.9,21.64) v1(80.9,11.35) v1(81.31,51.49) v1(82.3,55.8) v1(82.55,21.64) v1(82.62,11.35) v1(84.33,21.64) v1(84.32,11.35) v1(85.22,7.42) v1(85.39,51.49) v1(86.02,11.35) v1(86.23,55.8) v1(87.32,51.49) v1(88.26,47.17) v1(88.39,43.74) v1(89.28,28.25) v1(89.92,25.2) v1(90.04,19.36) v1(90.06,1.07) v1(91.06,43.99) v1(91.31,47.17) v1(91.69,31.04) v1(91.82,3.1) v1(91.95,22.15) v1(91.98,1.07) v1(92.22,51.49) v1(92.41,35.94) v1(93.47,41.71) v1(93.9,14.11) v1(93.9,12.47) v1(93.9,10.66) v1(93.9,8.74) v1(93.9,6.83) v1(93.9,4.91) v1(93.9,2.99) v1(93.9,1.07) v1(95.12,15.05) v1(97.04,15.05) v1(97.92,38.91) v1(98.24,27.6) v1(98.93,36.63) v1(98.93,25.83) v1(98.96,15.05) v1(101.24,15.27) v1(101.24,14.61) v1(101.98,15.27) v1(101.98,14.61) v1(102.49,47.3) v1(102.49,24.56) v1(103.12,15.16) v1(103.76,57.46) v1(104.52,35.23) v1(104.9,38.41) v1(105.17,15.16) v1(106.32,15.27) v1(106.32,14.61) v1(107.06,15.27) v1(107.06,14.61) v1(107.57,48.06) v1(107.82,30.28) v1(108.08,52.12) v1(108.08,15.16) v1(109.47,38.79) v1(110.11,29.52) v1(110.49,15.16) v1(110.74,36.75) v1(111.12,43.99) v1(111.25,19.48) v1(112.27,57.46) v1(112.9,15.42) v1(113.28,53.77) v1(114.05,43.48) v1(115.32,15.16) v1(116.21,27.74) v1(116.21,16.94) v1(116.33,53.01) v1(116.46,35.23) v1(116.46,24.69) v1(116.59,38.53) v1(116.84,42.34) v1(119,49.84) v1(119,43.61) v1(119,41.58) v1(119,39.55) v1(119,37.52) v1(119,35.48) v1(119,33.45) v1(119,31.42) v1(119,29.39) v1(119,27.36) v1(119,25.32) v1(119,23.29) v1(119,21.26) v1(119,19.23) v1(119,17.2) v1(119.13,57.58)
VBAT: length 72.3
  Top Layer w0.254: U16.6 64.31,12.07 64.31,10.29 68,6.6 C52.1 69.65,6.6 71.37,4.88 72.64,4.88 v1(72.77,5) ; U23.7 114.3,10.85 114.3,16.31 113.72,16.89 v1(112.9,16.89) ; v1(92.33,5.77) v1(92.33,16.76)
  Bottom Layer w0.254: v1(92.33,5.77) 91.95,6.15 73.91,6.15 v1(72.77,5) ; v1(92.33,16.76) 112.78,16.76 v1(112.9,16.89)
VDDA: length 80.7
  Top Layer w0.254: U16.21 U16.22 71.25,16.45 C66.1 72.89,15.88 v1(72.87,15.88) ; C62.1 61.2,31.56 C65.1 ; 61.93,30.08 62.87,31.02 62.87,31.32 C63.1 61.61,31.05 C65.1 ; C65.1 60.69,31.04 U16.51 ; C65.1 60.71,31.04 60.71,28.37 64.9,24.18 v1(64.9,19.86)
  Bottom Layer w0.254: v1(64.9,19.86) 69.09,15.67 72.67,15.67 v1(72.87,15.88) 73.18,16.18 110.74,16.18 111.78,15.14 U23.5
ADIF_N_0: length 40.8
  Top Layer w0.254: H1.6 51.86,52.8 50.16,51.11 49.28,51.11 48.9,50.72 48.9,47.17 50.54,45.52 C4.2 50.61,44.93 C10.1 49.66,42.29 49.66,38.66 53.34,34.98 62.36,34.98 64.77,32.56 64.77,28.68 U16.44
ADIF_N_1: length 32.2
  Top Layer w0.254: 64.76,27.25 65.79,28.28 65.79,34.59 62.36,38.02 62.36,42.85 61.97,43.24 C13.1 61.27,44.89 C11.2 61.01,45.08 60.88,45.2 60.88,51.36 60.25,51.99 58.22,51.99 57.79,52.42 57.79,53.96 H1.12
ADIF_N_2: length 37
  Top Layer w0.254: H1.5 51.94,48.86 51.94,47.3 53.97,45.27 C14.2 54.16,44.89 C16.1 53.47,43.24 53.31,43.08 v1(53.31,38.63) ; v1(64.01,38.66) 66.8,35.87 66.8,26.47 U16.38
  Bottom Layer w0.254: v1(64.01,38.66) 53.34,38.66 v1(53.31,38.63)
ADIF_N_3: length 33.8
  Top Layer w0.254: v1(57.71,44.12) 57.71,44.15 57.72,44.16 ; U16.36 67.94,26.2 67.94,41.07 v1(64.96,44.06) ; 57.72,44.16 C19.1 ; 57.72,44.16 57.72,44.89 C17.2 57.86,45.41 H1.11
  Bottom Layer w0.254: v1(57.71,44.12) 64.9,44.12 v1(64.96,44.06)
ADIF_N_4: length 72.1
  Top Layer w0.254: v1(37.59,17.96) 37.59,24.44 31.95,30.07 31.95,42.8 31.52,43.24 C46.1 31.05,44.89 C44.2 30.86,45.08 30.86,45.52 29.84,46.53 29.84,50.6 30.61,51.36 31.37,51.36 32.81,52.8 H2.6 ; U16.62 56.51,25.52 56.51,23.55 58.93,21.13 v1(58.93,17.96)
  Bottom Layer w0.254: v1(37.59,17.96) v1(58.93,17.96)
ADIF_N_5: length 43.6
  Top Layer w0.254: U16.60 55.37,28.08 v1(55.37,28.12) ; H2.12 38.99,53.86 38.99,52.12 39.5,51.61 41.15,51.61 41.78,50.98 41.78,46.28 41.53,46.02 C47.2 41.72,44.89 C49.1 42.16,43.24 42.67,42.72 42.67,40.69 40.64,38.66 v1(40.64,32.94)
  Bottom Layer w0.254: v1(40.64,32.94) 40.89,33.2 50.29,33.2 v1(55.37,28.12)
ADIF_N_6: length 75.2
  Top Layer w0.254: H2.5 33.78,47.97 33.78,46.79 34.42,46.15 34.42,45.08 C38.2 34.6,44.89 C40.1 35.12,43.24 35.51,42.85 35.51,29.44 40.64,24.31 v1(40.64,13.64) ; v1(61.47,13.89) 61.47,22.66 59.44,24.69 59.44,25.43 U16.58
  Bottom Layer w0.254: v1(61.47,13.89) 61.21,13.64 v1(40.64,13.64)
ADIF_N_7: length 69.3
  Top Layer w0.254: v1(63.12,17.07) 63.12,23.67 60.96,25.83 60.45,25.83 U16.56 ; v1(42.29,17.32) 42.29,25.58 38.35,29.52 38.35,39.29 39.04,39.98 39.04,42.77 38.58,43.24 C43.1 38.16,44.76 C41.2 37.97,45.21 37.97,46.03 38.81,46.87 H2.11
  Bottom Layer w0.254: v1(42.29,17.32) 62.87,17.32 v1(63.12,17.07)
ADIF_P_0: length 46.5
  Top Layer w0.254: H1.4 49.86,52.25 49.48,51.87 47.5,51.87 46.67,51.04 46.67,45.71 47.37,45.01 49.13,45.01 C4.1 49.14,43.55 C9.1 48.82,43.23 48.13,43.23 47.78,42.88 v1(47.78,39.45) ; v1(61.09,38.02) 65.28,33.83 65.28,28.48 U16.43
  Bottom Layer w0.254: v1(61.09,38.02) 49.21,38.02 v1(47.78,39.45)
ADIF_P_1: length 37.8
  Top Layer w0.254: 65.11,26.9 66.29,28.08 66.29,35.1 63.12,38.28 v1(63.12,46.15) ; C12.1 59.69,43.43 C11.1 59.69,45.08 v1(59.69,46.15) 58.86,46.98 58.86,50.79 58.42,51.23 56.9,51.23 55.86,52.26 H1.10
  Bottom Layer w0.254: v1(63.12,46.15) v1(59.69,46.15)
ADIF_P_2: length 40.2
  Top Layer w0.254: H1.3 49.98,48.82 50.55,48.82 50.8,48.57 50.8,47.42 52.58,45.64 52.58,45.08 C14.1 52.57,43.43 C15.1 52.38,43.23 v1(51.56,43.23) ; v1(64.26,43.23) 64.2,43.17 64.2,43.04 67.37,39.87 67.37,26.33 66.53,25.48
  Bottom Layer w0.254: v1(64.26,43.23) v1(51.56,43.23)
ADIF_P_3: length 39
  Top Layer w0.254: C18.1 56.13,43.43 56.13,45.08 ; v1(55.37,45.14) 56.07,45.14 56.13,45.08 ; 56.13,45.08 56.13,48.67 H1.9 ; v1(65.53,45.14) 68.58,42.09 68.58,26.12 U16.35
  Bottom Layer w0.254: v1(65.53,45.14) v1(55.37,45.14)
ADIF_P_4: length 74.3
  Top Layer w0.254: v1(59.69,18.59) 59.69,21.51 57.28,23.93 57.28,25.47 U16.61 ; H2.4 30.81,53.09 29.08,51.36 28.32,51.36 27.69,50.72 27.69,45.77 28.32,45.14 29.4,45.14 C44.1 29.46,43.43 C45.1 29.79,43.24 30.17,42.85 30.17,40.36 31.11,39.42 31.11,29.52 36.83,23.8 v1(36.83,18.59)
  Bottom Layer w0.254: v1(36.83,18.59) v1(59.69,18.59)
ADIF_P_5: length 65.8
  Top Layer w0.254: 56.91,27.25 56.91,27.22 57.91,26.21 57.91,24.69 60.58,22.02 60.58,20.23 v1(60.69,20.12) ; H2.10 36.81,52.01 37.85,50.98 39.37,50.98 39.75,50.6 39.75,46.91 40.13,46.53 40.13,45.08 C47.1 40.13,43.43 C48.1 40.31,43.24 40.84,42.7 40.84,40.77 39.37,39.29 39.37,29.9 43.18,26.09 v1(43.18,19.99)
  Bottom Layer w0.254: v1(43.18,19.99) 43.43,19.74 60.58,19.74 60.69,19.85 v1(60.69,20.12)
ADIF_P_6: length 75
  Top Layer w0.254: v1(39.88,15.27) 39.88,23.67 33.73,29.82 33.73,42.77 33.27,43.24 C39.1 32.83,44.89 C38.1 33.02,45.4 30.99,47.42 30.99,48.76 H2.3 ; U16.57 62.23,23.34 v1(62.23,15.11)
  Bottom Layer w0.254: v1(39.88,15.27) 58.13,15.27 58.31,15.09 62.2,15.09 v1(62.23,15.11)
ADIF_P_7: length 67.2
  Top Layer w0.254: 58.32,28.67 59.5,27.48 60.58,27.48 63.88,24.18 v1(63.88,19.23) ; H2.9 36.81,47.15 36.44,46.78 C41.1 36.38,45.01 C42.1 36.98,43.24 37.31,42.9 37.31,29.16 41.4,25.07 v1(41.4,19.23)
  Bottom Layer w0.254: v1(41.4,19.23) 41.45,19.18 63.83,19.18 v1(63.88,19.23)
BTN_FUNCTION_0: length 56.4
  Top Layer w0.254: U16.63 53.72,27.61 53.72,31.03 C29.2 53.97,31.28 53.97,32.44 50.16,36.25 v1(48.9,36.25) ; v1(16.89,50.09) R57.2
  Bottom Layer w0.254: v1(16.89,50.09) 16.89,44.51 22.36,39.04 46.99,39.04 48.9,37.14 v1(48.9,36.25)
BTN_FUNCTION_1: length 62.4
  Top Layer w0.254: R92.2 7.63,46.52 8.51,45.64 14.35,45.64 v1(17.4,42.6) ; v1(47.88,37.14) 47.88,35.79 52.57,31.09 C30.2 52.59,29.88 52.96,29.52 52.96,27.67 U16.64
  Bottom Layer w0.254: v1(17.4,42.6) 21.59,38.41 46.61,38.41 v1(47.88,37.14)
CAN_RX: length 5.2
  Top Layer w0.254: U16.70 51.44,24.94 50.55,24.94 49.24,26.25 R133.2
CAN_TX: length 5.7
  Top Layer w0.254: U16.71 51.62,24.05 48.9,24.05 47.86,25.09 R132.2
DAC_OUT_0: length 9
  Top Layer w0.254: 76.85,23.81 75.69,24.97 R134.2 75.59,24.85 75.18,24.44 71.13,24.44 U16.29
GPIO_0: length 72.9
  Top Layer w0.254: v1(81.79,7.67) 81.79,37.64 73.28,46.15 73.28,50.85 72.26,51.87 U25.8 ; v1(62.46,13.23) 63.34,12.35 63.34,12.33
  Bottom Layer w0.254: v1(81.79,7.67) 81.74,7.72 67.98,7.72 v1(62.46,13.23)
GPIO_1: length 71.6
  Top Layer w0.254: U25.10 74.29,53.71 74.29,51.99 75.31,50.98 75.31,46.66 83.44,38.53 v1(83.44,8.81) ; 65.11,14.1 65.1,14.1 v1(64.29,14.91)
  Bottom Layer w0.254: v1(64.29,14.91) 70.38,8.81 v1(83.44,8.81)
GPIO_2: length 72
  Top Layer w0.254: U25.12 76.33,53.67 76.33,52.12 77.29,51.16 77.29,47.22 85.22,39.29 v1(85.22,9.83) ; v1(64.9,15.8) 64.9,15.02 U16.11
  Bottom Layer w0.254: v1(64.9,15.8) 70.87,9.83 v1(85.22,9.83)
GPIO_3: length 58.1
  Top Layer w0.254: v1(86.11,17.32) 86.11,40.31 79.26,47.15 79.26,50.99 78.26,51.99 U25.14 ; v1(69.98,16.56) 69.01,16.56 U16.19
  Bottom Layer w0.254: v1(86.11,17.32) 70.74,17.32 v1(69.98,16.56)
I2C_SCL: length 77.8
  Top Layer w0.254: v1(47.12,36.25) 47.12,34.21 49.66,31.67 49.66,31.2 R117.1 R112.2 ; U24.11 7.68,11.31 7.68,15.1 7.11,15.67 5.81,15.67 D46.1 4.35,16.66 3.81,17.2 3.81,29.77 7.62,33.58 18.42,33.58 22.8,37.96 24.58,37.96 U20.6 26.2,37.98 v1(26.42,37.77)
  Bottom Layer w0.254: v1(47.12,36.25) 47.12,36.75 46.1,37.77 v1(26.42,37.77)
I2C_SDA: length 73.4
  Top Layer w0.254: R113.2 R116.1 48.01,29.6 48.01,30.79 46.23,32.56 v1(46.23,36.63) ; v1(27.18,37.14) 26.75,36.71 U20.5 24.52,36.63 23.75,36.63 19.69,32.56 8.25,32.56 6.73,31.04 6.73,21.51 7.67,20.57 7.67,17.91 8.64,16.94 D47.1 10.29,15.01 10.29,11.24 U24.10
  Bottom Layer w0.254: v1(27.18,37.14) 45.72,37.14 v1(46.23,36.63)
MCU_1WIRE_0: length 8.6
  Top Layer w0.254: 61.93,10.92 61.93,7.34 64.64,4.62 65.07,4.62 R119.1
MCU_1WIRE_1: length 5
  Top Layer w0.254: U16.2 62.82,10.73 62.82,8.1 63.92,6.99 63.96,6.99
MCU_1WIRE_2: length 8
  Top Layer w0.254: U16.3 63.32,10.94 63.32,8.87 66.81,5.38 R123.1
MCU_1WIRE_3: length 4.6
  Top Layer w0.254: U16.4 63.81,11.16 63.81,9.66 R125.1
MCU_DIG_IN_0: length 8.7
  Top Layer w0.254: U16.85 53.09,14.87 53.09,12.13 R9.1
MCU_DIG_IN_1: length 5.5
  Top Layer w0.254: R84.1 52.58,12.88 52.58,15.07 U16.84
MCU_DIG_IN_2: length 8.3
  Top Layer w0.254: U16.83 52.07,15.27 52.07,13.64 48.99,10.56 R85.1
MCU_DIG_IN_3: length 5.1
  Top Layer w0.254: 53.37,17.28 53.37,17.23 51.44,15.29 51.44,14.28 50.52,13.36 R86.1
MCU_DIG_IN_4: length 8.1
  Top Layer w0.254: U16.81 50.8,15.42 50.8,14.78 47.82,11.81 R87.1
MCU_DIG_IN_5: length 4.8
  Top Layer w0.254: U16.80 49.27,14.59 R88.1
MCU_DIG_IN_6: length 8
  Top Layer w0.254: U16.79 50.15,16.18 49.66,16.18 46.54,13.06 46.48,13.06
MCU_DIG_IN_7: length 5.2
  Top Layer w0.254: R90.1 48,15.92 48.9,16.82 50.08,16.82 51.96,18.7
MCU_I2C_SCL: length 5.5
  Top Layer w0.254: U16.68 51.82,25.98 51.82,28.25 51.49,28.57 R112.1
MCU_I2C_SDA: length 5
  Top Layer w0.254: 53.37,23.72 50.67,26.42 50.67,26.94 50.19,27.42
MCU_SMB_ALERT: length 7.1
  Top Layer w0.254: U16.91 55.75,13.3 55.75,11.48 56.77,10.47 56.77,9.45 55.62,8.3 R83.1
MCU_SMB_CLK: length 8.3
  Top Layer w0.254: R81.1 45.26,14.32 48.39,17.45 50.01,17.45 51.6,19.05
MCU_SMB_DATA: length 10.3
  Top Layer w0.254: U16.93 56.39,12.52 56.39,11.61 57.66,10.34 57.66,9.19 54.02,5.56 R82.1
MCU_STACK_ENABLE: length 49.8
  Top Layer w0.254: R118.1 22.09,17.96 v1(22.48,17.96) ; U16.67 54.11,24.42 58.04,20.5 v1(58.04,14.53)
  Bottom Layer w0.254: v1(58.04,14.53) 57.53,14.53 57.51,14.51 39.14,14.51 38.61,15.04 25.78,15.04 22.86,17.96 v1(22.48,17.96)
PWM_OUT_0: length 56
  Top Layer w0.254: v1(55.88,24.44) 55.48,24.44 U16.65 ; v1(80.9,23.55) 80.9,37.14 72.26,45.77 U25.7
  Bottom Layer w0.254: v1(80.9,23.55) 56.77,23.55 v1(55.88,24.44)
PWM_OUT_1: length 61.4
  Top Layer w0.254: v1(82.68,22.91) 82.68,38.02 74.29,46.41 74.29,49.21 U25.9 ; U16.66 53.54,25.67 v1(53.54,25.68)
  Bottom Layer w0.254: v1(53.54,25.68) 56.31,22.91 v1(82.68,22.91)
PWM_OUT_2: length 44.1
  Top Layer w0.254: v1(84.33,22.91) 84.33,38.91 76.26,46.98 U25.11 ; v1(71.75,22.28) 71.1,22.28 U16.26
  Bottom Layer w0.254: v1(84.33,22.91) 83.69,22.28 v1(71.75,22.28)
RESET: length 150.4
  Top Layer w0.254: CN3.12 5.85,35.99 6.35,35.99 8.86,38.5 D9.1 9.02,38.53 9.91,39.42 12.06,39.42 TP18.1 v1(14.1,38.53) ; SW2.2 98.8,50.18 98.71,50.09 97.41,50.09 96.77,49.45 96.77,46.41 92.39,42.02 v1(92.39,37.26) ; R50.1 75.87,12.29 R10.1 76.43,12.12 78.61,12.12 78.87,12.37 78.87,32.18 v1(73.79,37.26)
  Bottom Layer w0.254: v1(14.1,38.53) 14.73,37.9 14.73,35.36 16,34.09 29.38,34.09 30.51,35.22 51.42,35.22 53.47,37.26 v1(73.79,37.26) v1(92.39,37.26)
SIG_LED_0: length 6.2
  Top Layer w0.254: 73.26,27.31 72.04,26.09 71.37,26.09 U16.31
SIG_LED_1: length 6.3
  Top Layer w0.254: U16.32 71.37,26.8 71.37,27.74 72.09,28.46 R102.2
SMB_ALERT: length 63.3
  Top Layer w0.254: R83.2 54.48,7.16 51.44,4.12 37.85,4.12 34.67,7.29 v1(34.67,16.69) ; D42.1 13.18,16.66 v1(13.21,16.69)
  Bottom Layer w0.254: U24.4 13.21,10.86 v1(13.21,16.69) 13.21,18.47 14.22,19.48 23.88,19.48 26.67,16.69 v1(34.67,16.69)
SMB_CLK: length 52.8
  Top Layer w0.254: v1(39.12,20.12) 39.12,14.15 40.39,12.88 43.78,12.88 44.15,13.26 ; D35.1 6.83,16.56 v1(7.49,16.56)
  Bottom Layer w0.254: U24.2 7.49,11.5 v1(7.49,16.56) 7.49,17.2 11.3,21.01 27.69,21.01 28.71,19.98 38.98,19.98 v1(39.12,20.12)
SMB_DATA: length 65.1
  Top Layer w0.254: 52.96,4.45 52.92,4.45 51.05,2.59 38.1,2.59 33.91,6.78 v1(33.91,17.7) ; v1(11.3,16.69) 11.27,16.66 D41.1
  Bottom Layer w0.254: v1(33.91,17.7) 28.32,17.7 25.78,20.24 13.84,20.24 11.3,17.7 v1(11.3,16.69) 11.3,11.42 U24.3
SPI1_MISO: length 9.6
  Top Layer w0.254: U16.90 55.25,13.5 55.25,11.1 55.82,10.53 55.82,9.77 52.83,6.78 52.76,6.78
SPI1_MOSI: length 7.6
  Top Layer w0.254: 51.96,22.3 51.22,23.04 50.42,23.04 49.28,21.9 46.37,21.9 R128.1
SPI1_SCK: length 6.7
  Top Layer w0.254: U16.30 71.06,25.07 73.36,25.07 R127.1
STACK_ENABLE: length 9.1
  Top Layer w0.254: U24.9 13.59,11.17 13.59,14.78 14.22,15.42 D48.1 15.46,16.66 H6.1
STATUS_LED_BLU: length 5.9
  Top Layer w0.254: R54.2 75.78,18.82 70.99,18.82 U16.25
STATUS_LED_GRN: length 5.2
  Top Layer w0.254: U16.24 70.9,18.21 74.29,18.21 74.73,17.78 R60.1
STATUS_LED_RED: length 8.2
  Top Layer w0.254: R65.1 76.21,14.9 73.66,17.45 70.95,17.45 69.71,18.7
STL_COM_RX: length 6.8
  Top Layer w0.254: R26.1 70.86,29.64 70.36,29.13 70.36,26.49 U16.33
STL_COM_TX: length 7.3
  Top Layer w0.254: U16.34 69.34,26.18 69.34,30.4 69.75,30.81 R28.1
SWCLK: length 5.5
  Top Layer w0.254: U16.76 50.06,18.21 47.85,18.21 R23.1
SWDIO: length 6.8
  Top Layer w0.254: U16.72 51.42,23.55 50.16,23.55 49.4,22.78 48.01,22.78 46.87,23.92 46.69,23.92
TRACESWO: length 5.9
  Top Layer w0.254: U16.89 54.74,13.7 54.74,10.01 R27.1
USART2_RX: length 9
  Top Layer w0.254: U16.87 54.23,14.6 54.23,10.85 51.51,8.12 R130.1
USART2_TX: length 5.8
  Top Layer w0.254: R131.1 53.72,11.51 53.72,14.8 U16.86
VREF: length 77.3
  Top Layer w0.254: U16.52 58.15,30.96 C58.2 58.03,31.18 57.48,30.63 ; 56.88,30.04 57.48,30.63 ; 57.48,30.63 57.85,30.25 v1(57.91,30.25)
  Bottom Layer w0.254: U23.6 114.32,19.46 111.1,22.68 100.61,22.68 99.16,24.13 58.17,24.13 57.91,24.38 v1(57.91,30.25)
$1N2844: length 53.7
  Top Layer w0.254: v1(11.94,24.69) 11.56,24.69 ; R9.2 47.5,6.54 47.5,6.53 46.74,5.77 37.59,5.77 35.43,7.93 35.43,17.45 33.91,18.97 v1(33.91,21.83)
  Bottom Layer w0.254: v1(33.91,21.83) 21.4,21.83 19.18,24.05 12.57,24.05 v1(11.94,24.69)
$1N2847: length 54.4
  Top Layer w0.254: H3.5 13.13,25.15 13.59,24.69 v1(13.97,24.69) ; R84.2 46.99,7.29 37.34,7.29 36.19,8.43 36.19,17.83 34.67,19.36 v1(34.67,22.97)
  Bottom Layer w0.254: v1(34.67,22.97) 21.27,22.97 19.56,24.69 v1(13.97,24.69)
$1N2850: length 49.3
  Top Layer w0.254: R85.2 47.8,9.36 47.66,9.36 46.35,8.05 v1(46.23,8.05) ; H3.9 17.26,25.44 v1(17.91,26.09) ; v1(32.39,8.05) 32.41,8.08 32.41,25.3 v1(32.39,25.32)
  Bottom Layer w0.254: v1(32.39,25.32) 24.51,25.32 23.75,26.09 v1(17.91,26.09) ; v1(32.39,8.05) v1(46.23,8.05)
$1N2853: length 47.6
  Top Layer w0.254: H3.11 19.95,25.44 v1(20,25.39) ; v1(45.59,8.81) 46,8.81 R86.2 ; v1(33.15,24.05) v1(33.15,8.81)
  Bottom Layer w0.254: v1(33.15,24.05) 21.34,24.05 v1(20,25.39) ; v1(33.15,8.81) v1(45.59,8.81)
$1N3203: length 56.7
  Top Layer w0.254: v1(29.21,9.58) v1(29.21,30.28) ; v1(45,9.55) 45.53,10.08 46.02,10.08 46.67,10.73 R87.2 ; v1(11.99,31.29) 11.56,31.29
  Bottom Layer w0.254: v1(29.21,30.28) 28.19,31.29 v1(11.99,31.29) ; v1(29.21,9.58) 29.23,9.55 v1(45,9.55)
$1N3205: length 45.4
  Top Layer w0.254: v1(17.98,29.64) 17.53,29.64 ; R89.2 44.51,11.1 v1(43.69,11.1) ; v1(31.62,26.98) v1(31.62,11.1)
  Bottom Layer w0.254: v1(17.98,29.64) 17.98,29.44 20.45,26.98 v1(31.62,26.98) ; v1(31.62,11.1) v1(43.69,11.1)
$1N3207: length 45.4
  Top Layer w0.254: v1(43.05,11.86) 44.02,11.86 46.94,14.78 ; v1(19.94,29.64) 19.56,29.64 ; v1(30.73,27.99) v1(30.73,11.86)
  Bottom Layer w0.254: v1(19.94,29.64) 21.59,27.99 v1(30.73,27.99) ; v1(30.73,11.86) v1(43.05,11.86)
$1N3209: length 55.9
  Top Layer w0.254: H3.6 13.13,30.83 13.3,30.66 v1(13.97,30.66) ; v1(44.32,10.34) 45.01,10.34 R88.2 ; v1(29.97,10.34) v1(29.97,28.63)
  Bottom Layer w0.254: v1(29.97,10.34) v1(44.32,10.34) ; v1(29.97,28.63) 29.59,29.01 21.84,29.01 20.19,30.66 v1(13.97,30.66)
$1N5436: length 83.8
  Top Layer w0.254: v1(14.1,40.31) 12.98,40.31 TP50.1 12.09,41.2 9.91,41.2 9.02,40.31 D7.1 6.95,38.4 CN3.8 ; v1(28.45,34.72) v1(28.45,5.51) ; v1(50.16,5.44) R27.2
  Bottom Layer w0.254: v1(28.45,34.72) 16.38,34.72 15.37,35.74 15.37,39.04 v1(14.1,40.31) ; v1(50.16,5.44) 28.52,5.44 v1(28.45,5.51)
$1N5439: length 82.1
  Top Layer w0.254: CN3.13 4.44,34.09 4.89,33.64 6.41,33.64 7.75,34.98 D4.1 ; v1(72.52,35.74) 72.52,31.23 R26.2 ; v1(8.89,34.21) 8.89,34.95 D4.1 ; D4.1 9.02,34.98 9.78,35.74 12.22,35.74 TP31.1
  Bottom Layer w0.254: v1(8.89,34.21) 10.41,32.69 23.88,32.69 24.13,32.44 30.99,32.44 32.26,33.71 52.53,33.71 54.56,35.74 v1(72.52,35.74)
$1N5442: length 66.5
  Top Layer w0.254: 45.68,16.04 44.84,16.04 v1(44.83,16.05) ; CN3.6 6.09,39.67 8.51,42.09 D6.1 9.75,42.98 12.08,42.98 TP49.1 12.99,42.09 v1(14.1,42.09) ; v1(27.69,35.36) v1(27.69,15.82)
  Bottom Layer w0.254: v1(27.69,15.82) 39.01,15.82 39.24,16.05 v1(44.83,16.05) ; v1(14.1,42.09) 16,40.18 16,36.12 16.76,35.36 v1(27.69,35.36)
$1N5443: length 58
  Top Layer w0.254: CN3.4 5.84,40.94 7.37,42.47 7.37,43.36 7.87,43.87 D5.1 9.02,43.87 9.91,44.76 11.94,44.76 12.85,43.84 TP48.1 12.97,43.87 v1(14.1,43.87) ; R22.2 45.47,25.14 45.47,26.34 43.18,28.63 v1(43.18,35.87)
  Bottom Layer w0.254: v1(14.1,43.87) 16.64,41.33 16.64,36.5 17.2,35.94 43.1,35.94 v1(43.18,35.87)
$1N5454: length 75.7
  Top Layer w0.254: v1(71.12,36.63) 71.12,32.17 70.82,31.87 ; v1(13.97,36.75) 12.97,36.75 TP51.1 12.08,37.64 9.75,37.64 D8.1 8.51,36.75 6.48,34.72 5.85,34.72 CN3.14
  Bottom Layer w0.254: v1(71.12,36.63) 54.23,36.63 52.04,34.44 52.02,34.47 31.28,34.47 30.13,33.33 15.75,33.33 13.97,35.1 v1(13.97,36.75)
$1N6636: length 14.4
  Top Layer w0.254: 21.37,51.38 21.37,53.71 U9.1 ; 21.37,51.38 TP17.1 22.48,48.98 22.48,48.32 R52.1 ; 21.37,51.38 22.98,51.38 D17.1 ; 21.37,51.38 20.46,51.38 R57.1
$1N6640: length 65.3
  Top Layer w0.254: Q7.1 110.04,46.49 R66.1 110.22,44.61 109.09,43.48 96.52,43.48 93.09,40.06 v1(93.09,13.13) ; 77.41,13.83 78.1,13.14 v1(78.1,13.13)
  Bottom Layer w0.254: v1(78.1,13.13) v1(93.09,13.13)
$1N6642: length 67.9
  Top Layer w0.254: R60.2 76.18,16.71 v1(77.34,15.55) ; 113.36,47.94 113.36,46.46 R62.1 113.56,44.78 111.25,42.47 96.65,42.47 93.85,39.68 v1(93.85,15.42)
  Bottom Layer w0.254: v1(93.85,15.42) 77.47,15.42 v1(77.34,15.55)
$1N6643: length 66.5
  Top Layer w0.254: R54.1 77.73,17.96 v1(77.85,18.09) ; v1(94.62,18.47) 94.62,39.29 96.77,41.45 113.79,41.45 116.87,44.54 R55.1 116.68,46.5 Q3.1
  Bottom Layer w0.254: v1(94.62,18.47) 78.23,18.47 v1(77.85,18.09)
$1N6645: length 2.2
  Top Layer w0.254: R47.1 110.26,50.22 110.54,49.93 Q7.3
$1N6646: length 2.3
  Top Layer w0.254: R48.1 113.57,50.19 113.82,49.94 Q6.3
$1N6647: length 6
  Top Layer w0.254: R49.2 118.37,52.37 116.99,53.75 LED1.1
$1N6648: length 5.9
  Top Layer w0.254: LED1.4 116.19,56.04 115.06,54.92 115.06,51.6 115.07,51.59
$1N6649: length 7.9
  Top Layer w0.254: R47.2 111.76,51.6 111.76,55.04 114.17,57.45 LED1.3
$1N6650: length 2.3
  Top Layer w0.254: R49.1 116.86,50.22 117.12,49.95 Q3.3
$1N9398: length 15.5
  Top Layer w0.254: 12.27,51.31 9.47,51.31 9.14,50.97 R92.1 11.22,50.09 ; 12.27,51.31 13.9,51.31 14.22,50.98 14.22,50.1 D43.1 ; 12.27,51.31 12.45,51.49 12.45,54.79 U17.1 ; 11.22,50.09 10.93,49.8 R91.1 ; 11.22,50.09 TP52.1
$1N10424: length 2
  Top Layer w0.254: R97.2 98.05,57.46 99.22,57.46 LED2.1
$1N10441: length 45.1
  Top Layer w0.254: Q8.1 98.95,53.64 R99.1 96.26,53.64 95.25,52.63 95.25,46.91 90.93,42.6 v1(90.93,32.06) ; 74.32,28.37 74.32,28.4 v1(75.95,30.02)
  Bottom Layer w0.254: v1(90.93,32.06) 77.98,32.06 v1(75.95,30.02)
$1N10471: length 2.9
  Top Layer w0.254: R97.1 98.56,55.43 99.06,55.93 100.19,55.93 Q8.3
$1N10767: length 2.2
  Top Layer w0.254: LED3.1 107.03,57.63 106.22,57.63 106.04,57.46 106.04,57.45 R100.2
$1N10769: length 53.5
  Top Layer w0.254: v1(91.69,32.82) 91.69,42.47 96.01,46.79 96.01,50.98 96.27,51.23 104.9,51.23 105.53,51.86 R101.1 107.04,53.77 Q9.1 ; v1(74.68,30.91) 73.3,29.54 R102.1
  Bottom Layer w0.254: v1(91.69,32.82) 76.58,32.82 v1(74.68,30.91)
$1N10779: length 3
  Top Layer w0.254: R100.1 106.43,55.43 107.06,56.06 108.17,56.06 Q9.3
$1N12623: length 2.6
  Top Layer w0.254: R118.2 19.93,17.08 H6.2
$1N24471: length 14
  Top Layer w0.254: C50.2 73.04,7.94 X3.1 73.04,9.69 72.26,10.47 72.26,11.99 69.34,14.91 68.58,14.91 67.94,14.28 67.06,14.28 U16.13
$1N24472: length 5.6
  Top Layer w0.254: U16.12 67.62,13 C51.2 69.28,11.73 X3.2
$1N24475: length 10.5
  Top Layer w0.254: U16.8 65.02,12.77 65.02,11.86 64.77,11.61 64.77,10.59 67.44,7.93 68.89,7.93 X4.2 69.34,8.26 C1.2
$1N24476: length 4.3
  Top Layer w0.254: 67.73,10.69 C2.2 66.71,11.79 64.76,13.75
$1N24481: length 7.6
  Top Layer w0.254: U16.94 56.9,12.32 56.9,11.73 58.42,10.21 58.42,8.56 56.91,7.05 R11.2
$1N31636: length 10.5
  Top Layer w0.254: R10.2 74.92,13.55 73.38,15.09 C5.2 71.67,14.66 70.61,14.66 69.47,15.8 68.58,15.8 67.56,14.78 67.31,14.78 66.58,15.51 66.53,15.51
$1N35506: length 90.5
  Top Layer w0.254: v1(89.28,2.97) 89.28,23.42 91.31,25.45 v1(91.31,29.26) ; 66.64,3.06 66.93,2.76 66.93,2.72 67.11,2.54 75.77,2.54 v1(76.33,3.1) ; v1(108.46,29.13) 110.15,30.83 R120.2 112.51,30.79 116.84,30.79 117.35,31.29 117.35,35.74 116.84,36.25 CN4.3 ; 112.47,36.38 115.26,36.38 CN4.3 ; CN4.3 115.39,38.34 TP53.1
  Bottom Layer w0.254: v1(89.28,2.97) 76.45,2.97 v1(76.33,3.1) ; v1(91.31,29.26) 108.33,29.26 v1(108.46,29.13)
$1N35641: length 9.5
  Top Layer w0.254: CN4.2 112.31,34.25 112.47,34.09 R120.1 ; H4.2 111.72,34.25 109.63,34.25 108.97,34.91 C67.2
$1N36416: length 81.9
  Top Layer w0.254: R121.2 67.72,3.23 v1(75.18,3.23) ; v1(112.27,17.7) 112.65,18.09 112.65,20.23 R122.2 114.43,20.29 TP54.1 117.6,20.07 117.6,24.82 116.71,25.71 CN5.3 115.39,25.71 112.59,25.71 ; v1(90.04,3.73) v1(90.04,17.7)
  Bottom Layer w0.254: v1(75.18,3.23) 75.82,3.86 89.92,3.86 v1(90.04,3.73) ; v1(112.27,17.7) v1(90.04,17.7)
$1N36428: length 10.8
  Top Layer w0.254: C68.2 v1(109.09,24.5) ; H7.2 112.59,23.1 112.59,21.79 ; H7.2 111.51,24.18 v1(111.51,24.82) ; H7.2 CN5.2
  Bottom Layer w0.254: v1(109.09,24.5) 111.19,24.5 v1(111.51,24.82)
$1N36724: length 76.5
  Top Layer w0.254: v1(92.43,30.05) 92.43,24.54 90.81,22.91 v1(90.81,4.5) ; CN6.3 103.63,36.3 103.63,38.79 102.91,39.51 TP55.1 ; CN6.3 104.9,36.25 105.54,35.61 105.54,31.55 104.78,30.79 100.7,30.79 R124.2 100.61,30.79 v1(99.57,30.79) ; CN6.3 103.57,36.25 D51.1 ; R123.2 68,4.31 68.45,3.86 v1(74.42,3.86)
  Bottom Layer w0.254: v1(92.43,30.05) 98.83,30.05 v1(99.57,30.79) ; v1(90.81,4.5) 90.68,4.62 75.18,4.62 v1(74.42,3.86)
$1N36736: length 10.1
  Top Layer w0.254: R124.1 100.66,33.76 100.17,34.25 CN6.2 ; H8.2 100.01,34.34 97.92,34.34 97.22,35.04 C69.2
$1N37032: length 67.5
  Top Layer w0.254: R125.2 69.09,4.37 73.53,4.37 v1(73.66,4.5) ; D52.1 103.2,25.33 CN7.3 103.71,25.58 104.65,25.58 105.03,25.2 105.03,19.48 TP56.1 101.34,18.59 100.71,19.23 R126.2 99.82,20.51 98.42,19.1 v1(95.63,19.1) ; v1(91.58,19.16) 91.57,19.15 v1(91.57,5.18)
  Bottom Layer w0.254: v1(95.63,19.1) 95.57,19.16 v1(91.58,19.16) ; v1(91.57,5.18) 91.57,5.31 91.49,5.39 74.42,5.39 73.66,4.62 v1(73.66,4.5)
$1N37044: length 9.1
  Top Layer w0.254: R126.1 100.71,23.64 100.78,23.71 CN7.2 ; C70.2 97.47,24.37 98.17,23.67 100.01,23.67 H9.2
$1N38247: length 35.1
  Top Layer w0.254: v1(89.31,30.66) 89.31,44.09 86.26,47.14 U25.21 ; R127.2 76.2,27.91 v1(76.2,27.99)
  Bottom Layer w0.254: v1(89.31,30.66) 78.87,30.66 v1(76.2,27.99)
